# EAGLE design ConnectorBoard (EAGLE 8.4.1)
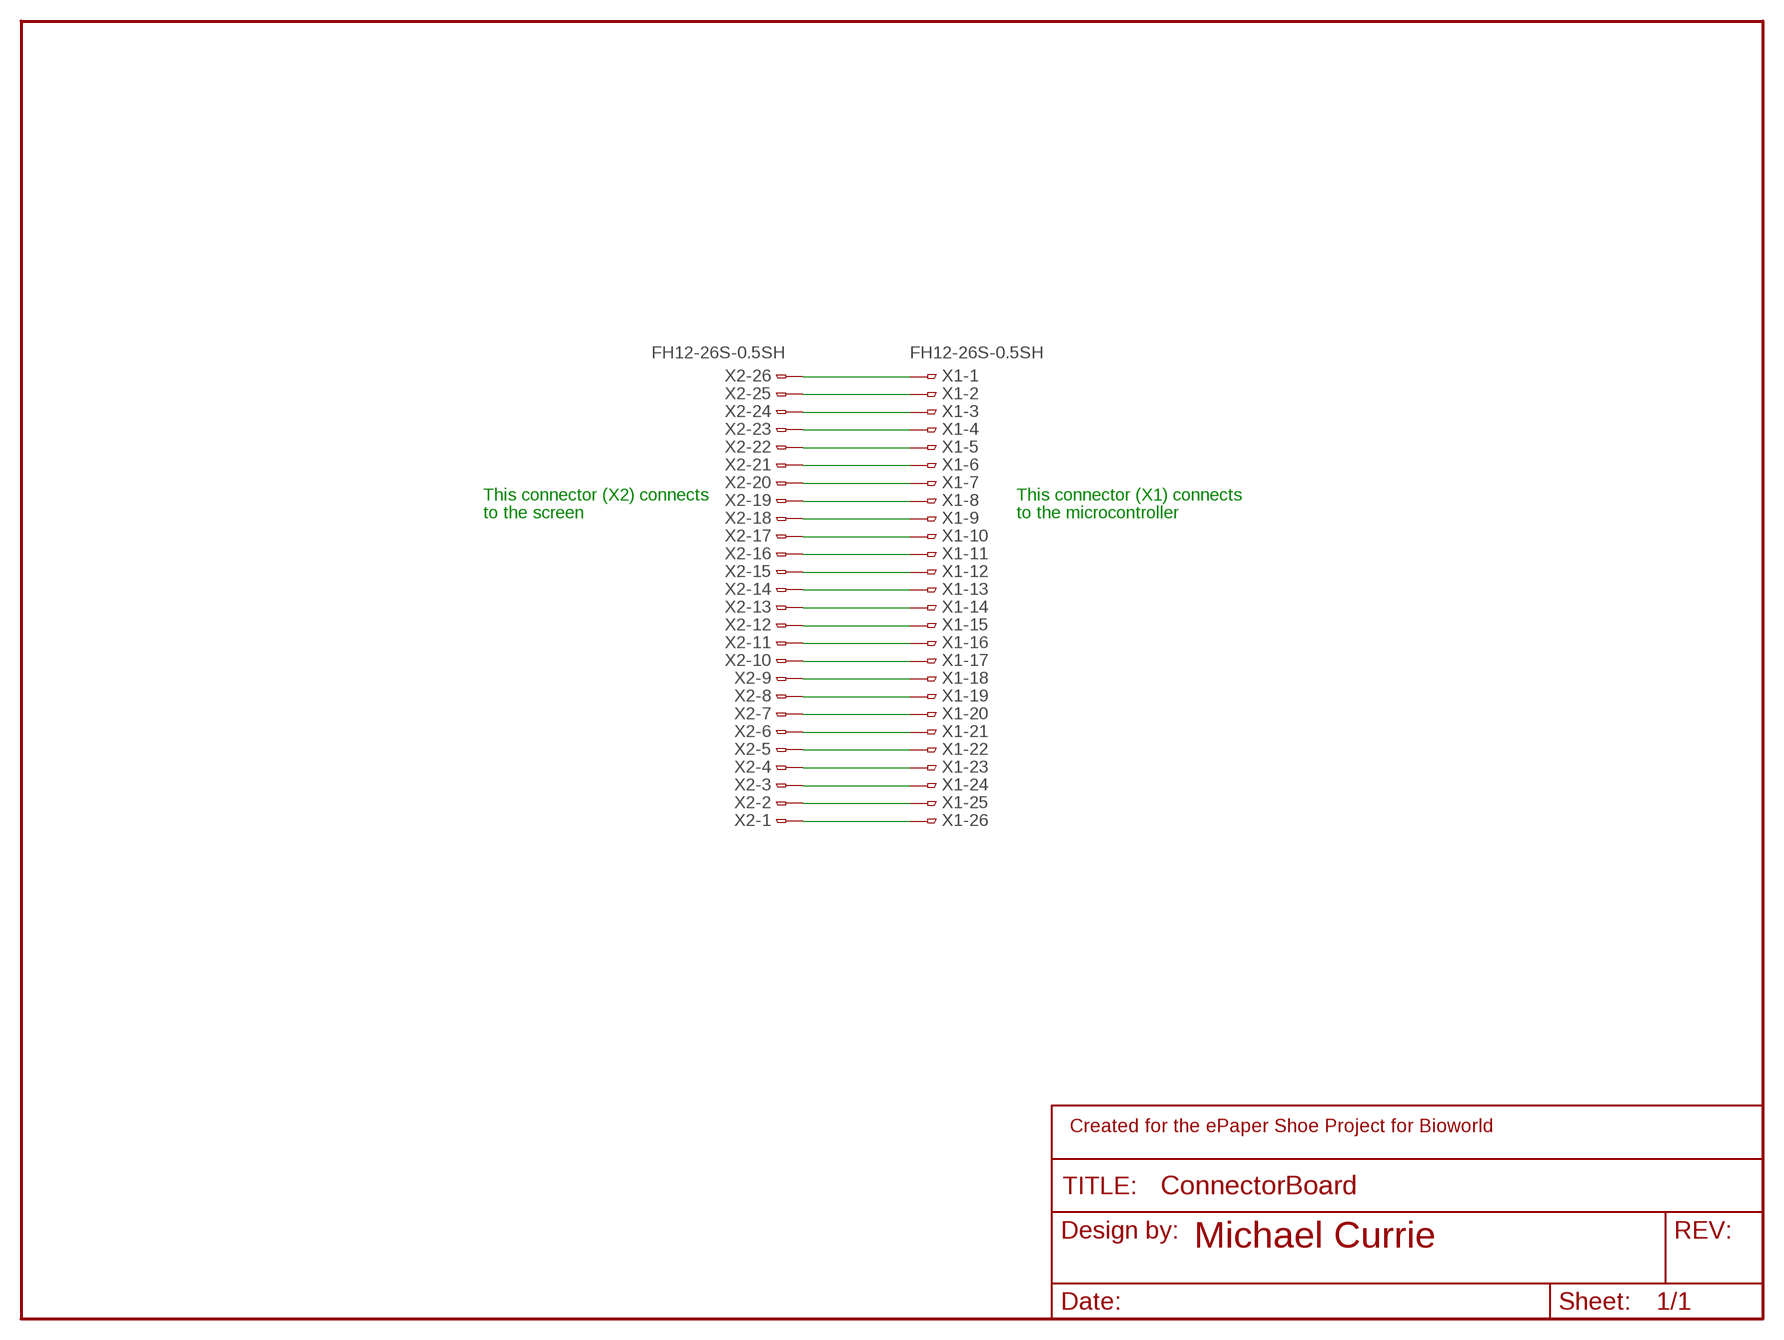
[diagram p0: schematic, sheet 1]

## Parts
FRAME1  FRAME-LETTER-MICHAELNO_PACKAGE  [DUMMY]
X1  FH12-26S-0.5SH  [FH12-26S-0.5SH]
X2  FH12-26S-0.5SH  [FH12-26S-0.5SH]

## Nets
N$1: X1.26 X2.1
N$2: X1.18 X2.9
N$3: X1.23 X2.4
N$4: X1.24 X2.3
N$5: X1.22 X2.5
N$6: X1.21 X2.6
N$7: X1.20 X2.7
N$8: X1.25 X2.2
N$9: X1.19 X2.8
N$10: X1.17 X2.10
N$11: X1.16 X2.11
N$12: X1.15 X2.12
N$13: X1.14 X2.13
N$14: X1.13 X2.14
N$15: X1.12 X2.15
N$16: X1.11 X2.16
N$17: X1.10 X2.17
N$18: X1.9 X2.18
N$19: X1.2 X2.25
N$20: X1.7 X2.20
N$21: X1.6 X2.21
N$22: X1.5 X2.22
N$23: X1.3 X2.24
N$24: X1.4 X2.23
N$25: X1.8 X2.19
N$26: X1.1 X2.26

## Notes on the sheet
- This connector (X2) connects | This connector (X1) connects
- to the screen | to the microcontroller

## Library data of the parts
FRAME1 = SparkFun-Aesthetics:FRAME-LETTER-MICHAEL: Schematic Frame - Letter Standard 8.5x11 US Letter frame; DESIGNER: Nobody; VERSION: v01
X1 X2 = con-hirose:FH12-26S-0.5S: 0.5mm Pitch Connectors For FPC/FFC Source: Data sheet <http://www.hirose.co.jp/cataloge_hp/e58605370.pdf>; MPN: FH12-26S-0.5SH(55); OC_FARNELL: 1324553; OC_NEWARK: 34M6172

## Board
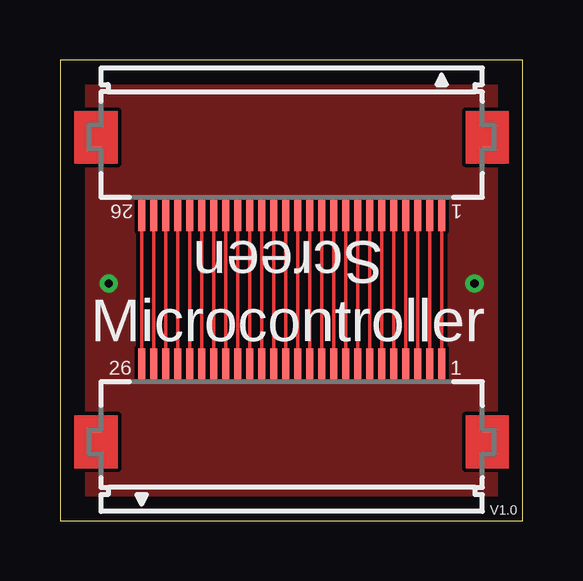
[diagram p1: board, top side]
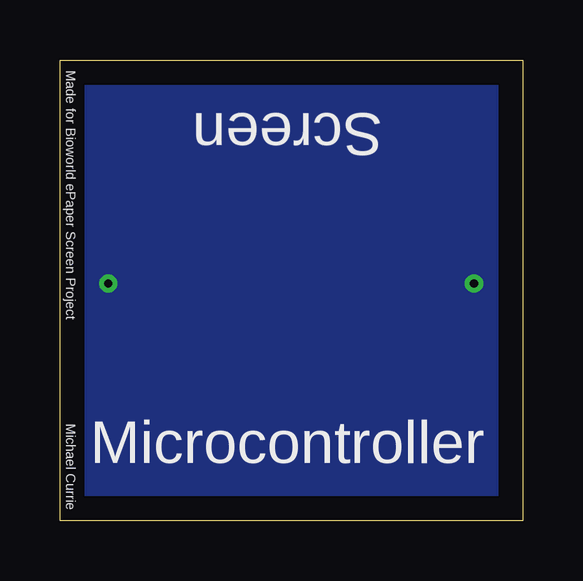
[diagram p2: board, bottom side, seen from below]

Size 19.28 x 19.23 mm. Coordinates in mm from the lower left corner, seen from the top.
Outline: 0,0 19.28,0 19.28,19.23 0,19.23 0,0
Copper layers (1*16): Top 0.035mm / dielectric 1.5mm / Bottom 0.035mm
Design rules "default": minimum track width 6mil, minimum drill 0.35mm, track to track 6mil, track to pad 6mil, pad to pad 6mil, via to via 6mil, smd to smd 6mil, copper to edge 40mil, drill to drill 6mil, minimum pad ring 10mil, minimum via ring 8mil, stop-mask expansion 4mil, vias tented up to drill 0mil, thermal gap 10mil

### Footprints (pad centres in the part's own frame; a part is rotated, then mirrored left to right if it is on the bottom)
FH12-26S-0.5SH = smd 0.3 x 1.3: 1 -6.25,3.25; 2 -5.75,3.25; 3 -5.25,3.25; 4 -4.75,3.25; 5 -4.25,3.25; 6 -3.75,3.25; 7 -3.25,3.25; 8 -2.75,3.25; 9 -2.25,3.25; 10 -1.75,3.25; 11 -1.25,3.25; 12 -0.75,3.25; 13 -0.25,3.25; 14 0.25,3.25; 15 0.75,3.25; 16 1.25,3.25; 17 1.75,3.25; 18 2.25,3.25; 19 2.75,3.25; 20 3.25,3.25; 21 3.75,3.25; 22 4.25,3.25; 23 4.75,3.25; 24 5.25,3.25; 25 5.75,3.25; 26 6.25,3.25

### Placement (x,y rotation side)
FRAME1  19.81,19.56 0 top
X1  9.65,3.3 0 top
X2  9.65,16 180 top

### Tracks (layer width: path | path; a pad name or v marks a point on that pad's centre or on a via)
GND  (via drill 0.35)
  other vias: 17.27,9.91 2.03,9.91
  pour Top: 0,19.3 19.3,19.3 19.3,0 0,0
  pour Bottom: 0.25,19.05 19.05,19.05 19.05,0.25 0.25,0.25
N$1
  Top 0.152: X2.1 X1.26
N$2
  Top 0.152: X2.9 X1.18
N$3
  Top 0.152: X2.4 X1.23
N$4
  Top 0.152: X2.3 X1.24
N$5
  Top 0.152: X1.22 X2.5
N$6
  Top 0.152: X1.21 X2.6
N$7
  Top 0.152: X1.20 X2.7
N$8
  Top 0.152: X2.2 X1.25
N$9
  Top 0.152: X2.8 X1.19
N$10
  Top 0.152: X1.17 X2.10
N$11
  Top 0.152: X1.16 X2.11
N$12
  Top 0.152: X1.15 X2.12
N$13
  Top 0.152: X1.14 X2.13
N$14
  Top 0.152: X1.13 X2.14
N$15
  Top 0.152: X1.12 X2.15
N$16
  Top 0.152: X1.11 X2.16
N$17
  Top 0.152: X1.10 X2.17
N$18
  Top 0.152: X1.9 X2.18
N$19
  Top 0.152: X2.25 X1.2
N$20
  Top 0.152: X1.7 X2.20
N$21
  Top 0.152: X1.6 X2.21
N$22
  Top 0.152: X1.5 X2.22
N$23
  Top 0.152: X2.24 X1.3
N$24
  Top 0.152: X2.23 X1.4
N$25
  Top 0.152: X2.19 X1.8
N$26
  Top 0.152: X1.1 X2.26

### Text on the board
tPlace: 26 | 1 | Screen | Microcontroller | 26 | 1 | V1.0
bPlace: Made for Bioworld ePaper Screen Project | Screen | Michael Currie | Microcontroller